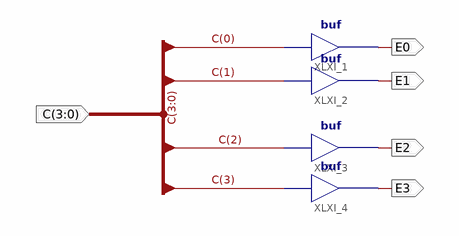
[diagram p0: schematic sheet 1]
// Xilinx ISE schematic Bus_Buffer.sch (spartan3e) as structural Verilog: 4 symbols, 5 ports
module Bus_Buffer (
  input  [3:0] C,
  output E0,
  output E1,
  output E2,
  output E3
);

  buf XLXI_1 (E0, C[0]);
  buf XLXI_2 (E1, C[1]);
  buf XLXI_3 (E2, C[2]);
  buf XLXI_4 (E3, C[3]);
endmodule
